# Altium schematic sheet MCU.SchDoc
size A4; SheetNumber: 3; SheetTotal: 5
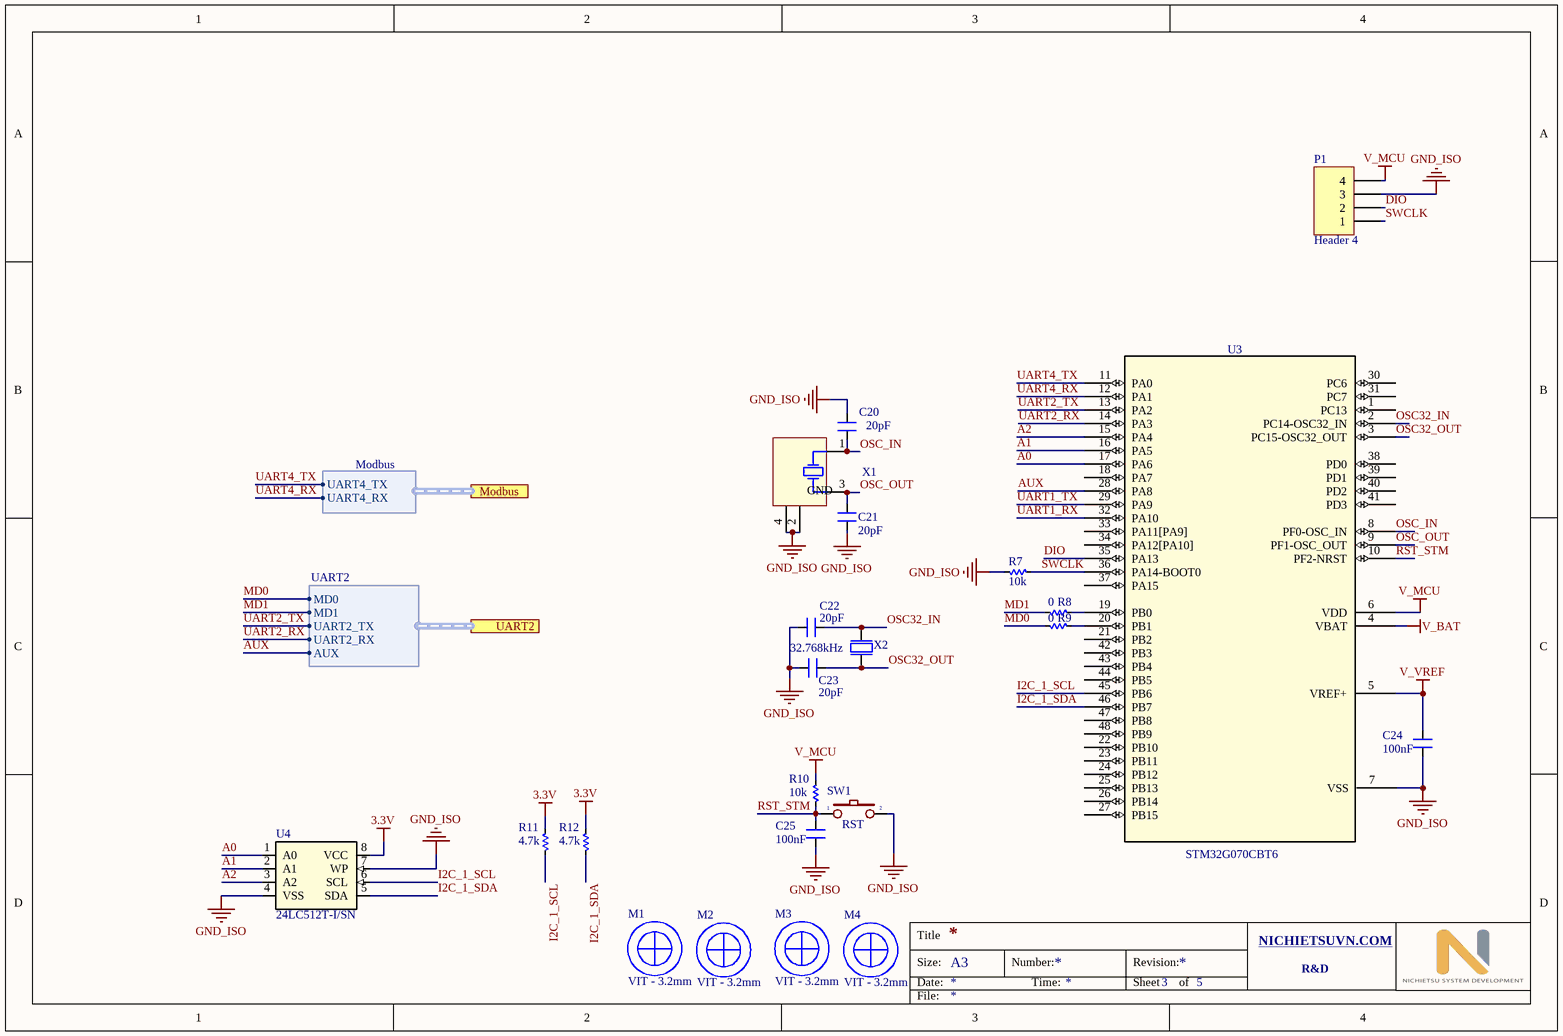
[diagram p0: MCU.SchDoc]

## Parts
C20  20pF  [CN-SMD-0603]
C21  20pF  [CN-SMD-0603]
C22  20pF  [CN-SMD-0603]
C23  20pF  [CN-SMD-0603]
C24  100nF  [CN-SMD-0603]
C25  100nF  [CN-SMD-0603]
M1  VIT - 3.2mm  [VIT - 3.2MM_2]
M2  VIT - 3.2mm  [VIT - 3.2MM_2]
M3  VIT - 3.2mm  [VIT - 3.2MM_2]
M4  VIT - 3.2mm  [VIT - 3.2MM_2]
P1  Header 4  [Header 4]
R7  10k  [RES-SMD-0603]
R8  0  [RES-SMD-0603]
R9  0  [RES-SMD-0603]
R10  10k  [RES-SMD-0603]
R11  4.7k  [RES-SMD-0603]
R12  4.7k  [RES-SMD-0603]
SW1  RST  [SW1-SMD]
U3  STM32G070CBT6  [STM32G070CBT6]
U4  24LC512T-I/SN  [24LC512]
X1  XT4  [XT4-16.000MHz-4_V]  (value not drawn)
X2  32.768kHz  [XTAL_3215]

## Ports
Modbus (harness Modbus), UART2 (harness UART2)

## Harnesses
Modbus: UART4_TX, UART4_RX
UART2: MD0, MD1, UART2_TX, UART2_RX, AUX

## Nets
3.3V: R11.1 R12.1 U4.8(VCC)
GND_ISO: C20.2 C21.1 C22.1 C23.1 C24.2 C25.2 P1.3 R7.2 SW1.2 U3.7(VSS) U4.4(VSS) U4.7(WP) X1.2(GND) X1.4(GND)
V_BAT: U3.4(VBAT)
V_MCU: P1.4 R10.1 U3.6(VDD)
V_VREF: C24.1 U3.5(VREF+)
A0: U3.17(PA6) U4.1(A0)
A1: U3.16(PA5) U4.2(A1)
A2: U3.15(PA4) U4.3(A2)
AUX: U3.28(PA8) ; port UART2.AUX
DIO: P1.2 U3.35(PA13)
I2C_1_SCL: R11.2 U3.45(PB6) U4.6(SCL)
I2C_1_SDA: R12.2 U3.46(PB7) U4.5(SDA)
MD0: R9.2 ; port UART2.MD0
MD1: R8.2 ; port UART2.MD1
OSC32_IN: C22.2 U3.2(PC14-OSC32_IN) X2.2(out)
OSC32_OUT: C23.2 U3.3(PC15-OSC32_OUT) X2.1(inp)
OSC_IN: C20.1 U3.8(PF0-OSC_IN) X1.1(XTAL)
OSC_OUT: C21.2 U3.9(PF1-OSC_OUT) X1.3(XTAL)
RST_STM: C25.1 R10.2 SW1.1 U3.10(PF2-NRST)
SWCLK: P1.1 R7.1 U3.36(PA14-BOOT0)
UART1_RX: U3.32(PA10)
UART1_TX: U3.29(PA9)
UART2_RX: U3.14(PA3) ; port UART2.UART2_RX
UART2_TX: U3.13(PA2) ; port UART2.UART2_TX
UART4_RX: U3.12(PA1) ; port Modbus.UART4_RX
UART4_TX: U3.11(PA0) ; port Modbus.UART4_TX
NetR8_1: R8.1 U3.19(PB0)
NetR9_1: R9.1 U3.20(PB1)

Not connected (* = marked no-connect by the designer): U3 1(PC13) 18(PA7) 21(PB2) 22(PB10) 23(PB11) 24(PB12) 25(PB13) 26(PB14) 27(PB15) 30(PC6) 31(PC7) 33(PA11[PA9]) 34(PA12[PA10]) 37(PA15) 38(PD0) 39(PD1) 40(PD2) 41(PD3) 42(PB3) 43(PB4) 44(PB5) 47(PB8) 48(PB9)

## Notes on the sheet
- Title
- Size:
- Date:
- A3
- Number:
- Time:
- Revision:
- Sheet
- of
- NICHIETSUVN.COM <http://NICHIETSUVN.COM>
- R&D
- File:

## Library data of the parts
C20-C25 = CN: Value: 33pF
M1-M4 = VIT - 3.2mm_1
P1 = Header 4: Header, 4-Pin; LatestRevisionDate: 17-Jul-2002; LatestRevisionNote: Re-released for DXP Platform.; Publisher: Altium Limited
R7-R12 = Res-SMD: Resistor; Manufacturer: Generic Components; Class: Passive; Published: 08/06/2000; Publisher: Altium Hobart Technology Centre
SW1 = SW2: Switch button 2 pin; Value: SW chip 2 pin
U3 = STM32G070CBT6: No Description Available; Vendor: STMicroelectronics; Built_By: EMA_UL_Team; SourceLibrary: Updates_to_database_2020-10-19; Manufacturer_Part_Number: STM32G070CBT6; Copyright: Copyright (C) 2018 Accelerated Designs. All rights reserved; RefDes: RefDes; Type: DEV
U4 = 24LC512T-I/SN: No Description Available; Mfr_Name: Microchip; Copyright: Copyright (C) 2022 Ultra Librarian. All rights reserved.; Manufacturer_Part_Number: 24LC512T-I/SN; RefDes: RefDes; Type: DEV
X1 = XT4: Crystal, 16 MHz, -30 to 85 degC, 3.2 x 2.5 x 0.9 mm SMD; Value: 4Mhz
X2 = XTAL_SMD3215: XTAL SMD 3215, 32.768kHz, Cl=9pF, Total Tol: ±50ppm; Part Number: XTAL_SMD3215_32.768kHz_9pF_General; Manufacturer: *; Manufacturer Part Number: *; LatestRevisionDate: 2016-08-19; Pin Count: 2; Publisher: Nordic Semiconductor; Published: 2016-08-19; Value: 32.768kHz; Footprint Doc: XTAL_3215